# Altium schematic sheet TransmisorVideo5_8GHz.SchDoc
size A4
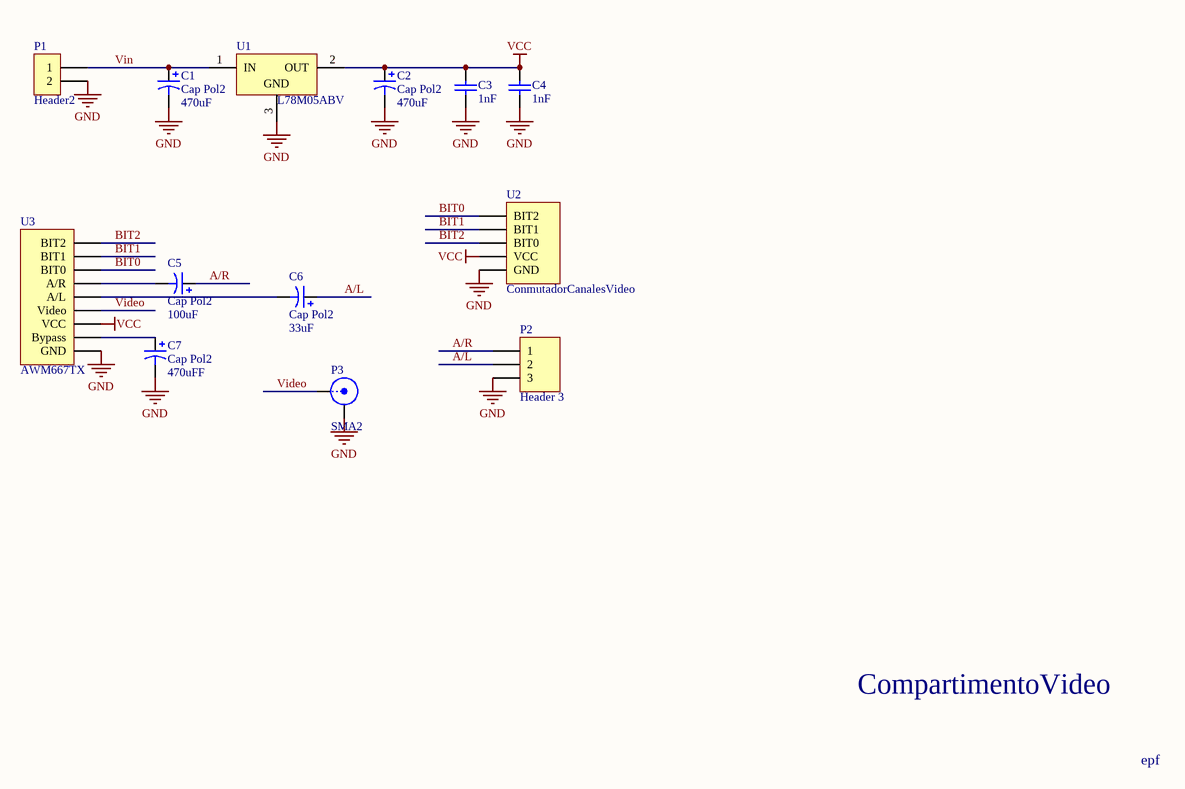
[diagram p0: TransmisorVideo5_8GHz.SchDoc]

## Parts
C1  Cap Pol2  value 470uF  [TC7360-2924]
C2  Cap Pol2  value 470uF  [TC7360-2924]
C3  value 1nF  [0805_CAP]  (hidden comment: Capacitor)
C4  value 1nF  [0805_CAP]  (hidden comment: Capacitor)
C5  Cap Pol2  value 100uF  [TC7360-2924]
C6  Cap Pol2  value 33uF  [TC7360-2924]
C7  Cap Pol2  value 470uFF  [TC7360-2924]
P1  Header2  [Header2Macho]
P2  Header 3  [HDR1X3]
P3  SMA2  [SMA-4HOLE]
U1  L78M05ABV  [TO220V]
U2  ConmutadorCanalesVideo  [Header 3x3]
U3  AWM667TX  [AWM667TX]

## Nets
GND: C1.2 C2.2 C3.1 C4.1 C7.2 P1.2 P2.3 P3.0(Y) U1.3(GND) U2.5(GND) U3.9(GND)
VCC: C2.1 C3.2 C4.2 U1.2(OUT) U2.4(VCC) U3.7(VCC)
A/L: C6.1 P2.2
A/R: C5.1 P2.1
BIT0: U2.1(BIT2) U3.3(BIT0)
BIT1: U2.2(BIT1) U3.2(BIT1)
BIT2: U2.3(BIT0) U3.1(BIT2)
Video: P3.1(X) U3.6(Video)
Vin: C1.1 P1.1 U1.1(IN)
NetC5_2: C5.2 U3.4(A/R)
NetC6_2: C6.2 U3.5(A/L)
NetC7_1: C7.1 U3.8(Bypass)

## Notes on the sheet
- CompartimentoVideo
- epf

## Library data of the parts
C1 C2 C5-C7 = Cap Pol2: Polarized Capacitor (Axial); Published: 8-Jun-2000; LatestRevisionDate: 17-Jul-2002; LatestRevisionNote: Re-released for DXP Platform.; PackageReference: POLAR0.8; Publisher: Altium Limited
C3 C4 = Cap
P2 = Header 3: Header, 3-Pin; LatestRevisionDate: 17-Jul-2002; LatestRevisionNote: Re-released for DXP Platform.; Publisher: Altium Limited
P3 = SMA2: BNC Elbow Connector; LatestRevisionDate: 17-Jul-2002; LatestRevisionNote: Re-released for DXP Platform.; Publisher: Altium Limited
U1 = L78M05ABV: Precision 500mA Regulator; Note: Tab is connected to pin 3 (GND).; Published: 24-Aug-2001; LatestRevisionDate: 17-Jul-2002; LatestRevisionNote: Re-released for DXP Platform.; DatasheetVersion: Mar-1997; PackageReference: TO220V; Publisher: Altium Limited; PackageDescription: TO, Thru-Hole, Vertical, Heatsink Mounted; 3 In-Line Leads; Pitch 2.54 mm; Pin sequence 1, 3, 2; ComponentLink1Description: Manufacturer Link; ComponentLink1URL: http://www.st.com/; ComponentLink2Description: Datasheet; ComponentLink2URL: http://www.st.com/stonline/products/literature/ds/2147/l78m05ab.pdf